# Altium schematic sheet Radio.SchDoc
size A
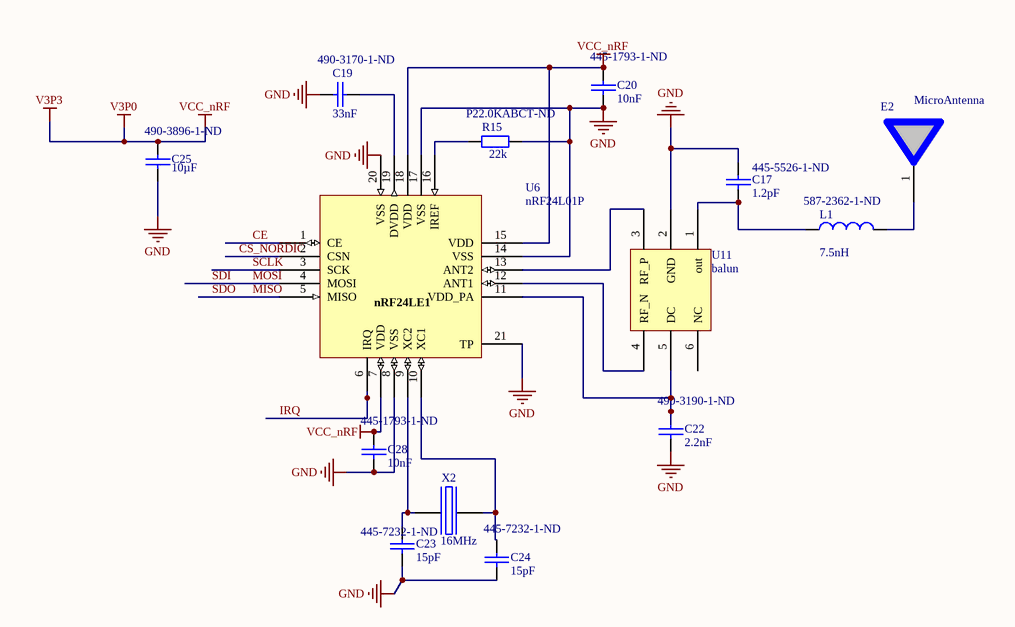
[diagram p0: Radio.SchDoc]

## Parts
C17  value 1.2pF  Supplier Part Number 1: 445-5526-1-ND  [0201]  (hidden comment: NP0 50V)
C19  value 33nF  Supplier Part Number 1: 490-3170-1-ND  [0201]  (hidden comment: NP0 50V)
C20  value 10nF  Supplier Part Number 1: 445-1793-1-ND  [0201]  (hidden comment: NP0 50V)
C22  value 2.2nF  Supplier Part Number 1: 490-3190-1-ND  [0201]  (hidden comment: NP0 50V)
C23  value 15pF  Supplier Part Number 1: 445-7232-1-ND  [0603]  (hidden comment: NP0 50V)
C24  value 15pF  Supplier Part Number 1: 445-7232-1-ND  [0603]  (hidden comment: NP0 50V)
C25  Supplier Part Number 1: 490-3896-1-ND  Capacitance: 10µF  [1608[0603]]  (hidden comment: NP0 50V)
C28  value 10nF  Supplier Part Number 1: 445-1793-1-ND  [0201]  (hidden comment: NP0 50V)
E2  MicroAntenna  [microantenna]
L1  value 7.5nH  Supplier Part Number 1: 587-2362-1-ND  [0201]  (hidden comment: Inductor)
R15  value 22k  Supplier Part Number 1: P22.0KABCT-ND  [0201]  (hidden comment: Res2)
U6  value nRF24L01P  [NORDIC_QFN20P400X400X90-25N]  (hidden comment: QFN24 4x4 package)
U11  balun  [balun]
X2  value 16MHz  [bt-xtal 2.5 x 2 mm]  (hidden comment: TSX-3225, 16MHz, Cl=9pF, +/-10ppm)

## Nets
GND: C17.1 C19.1 C20.2 C22.2 C23.2 C24.1 C25.2 C28.2 R15.2 U6.8(VSS) U6.14(VSS) U6.17(VSS) U6.20(VSS) U6.21(TP) U11.2(GND) X2.2(GND) X2.4(GND)
V3P0: C20.1 C25.1 C28.1 U6.7(VDD) U6.15(VDD) U6.18(VDD)  [also labelled V3P3, VCC_nRF]
CE: U6.1(CE)
CS_NORDIC: U6.2(CSN)
IRQ: U6.6(IRQ)
MISO: U6.5(MISO)  [also labelled SDO]
MOSI: U6.4(MOSI)  [also labelled SDI]
SCLK: U6.3(SCK)
NetC17_2: C17.2 L1.1 U11.1(out)
NetC19_2: C19.2 U6.19(DVDD)
NetC22_1: C22.1 U6.11(VDD_PA) U11.5(DC)
NetC23_1: C23.1 U6.9(XC2) X2.1(inp)
NetC24_2: C24.2 U6.10(XC1) X2.3(out)
NetE2_1: E2.1 L1.2
NetR15_1: R15.1 U6.16(IREF)
NetU6_12: U6.12(ANT1) U11.4(RF_N)
NetU6_13: U6.13(ANT2) U11.3(RF_P)

Not connected (* = marked no-connect by the designer): E2 2; U11 6(NC)

## Notes on the sheet
- (in symbol nRF24L01P - 4x4) nRF24LE1

## Library data of the parts
C17 = Cap: Capacitor; Part Field 1: 0402; Manufacturer: TDK Corporation; Manufacturer Part Number: C0603C0G1E1R2BTQ; Description: CAP CER 1.2PF 25V NP0 0201; Voltage - Rated: 25V; Tolerance: ±0.1pF; Temperature Coefficient: C0G, NP0; Supplier 1: Digi-Key; RoHS: RoHS Compliant; Category: Capacitors; Stock 1: 22019; Pricing 1: 1=0.33, 10=0.22, 100=0.088, 250=0.06324, 500=0.0451, 1000=0.033 (USD); Capacitance: 1.2pF; Mounting Type: Surface Mount, MLCC; Operating Temperature: -55°C ~ 125°C; Applications: RF, Microwave, High Frequency; Ratings: -; Package / Case: 0201 (0603 Metric); Size / Dimension: 0.024" L x 0.012" W (0.60mm x 0.30mm); Height - Seated (Max): -; Thickness (Max): 0.013" (0.33mm); Lead Spacing: -; Features: High Q, Low Loss; Packaging: Cut Tape (CT); Lead Style: -; ComponentLink1URL: http://www.tdk.com/pdf/high_q_B11.pdf; ComponentLink1Description: http://www.tdk.com/pdf/high_q_B11.pdf
C19 = Cap: Capacitor; Part Field 1: 0402; Manufacturer: Murata Electronics North America; Manufacturer Part Number: GRM033R60J333KE01D; Description: CAP CER 0.033UF 6.3V X5R 0201; Capacitance: 0.033µF; Voltage - Rated: 6.3V; Tolerance: ±10%; Temperature Coefficient: X5R; Supplier 1: Digi-Key; RoHS: RoHS Compliant; Category: Capacitors; Stock 1: 79017; Pricing 1: 10=0.05, 50=0.0396, 100=0.0297, 250=0.02144, 500=0.01584, 1000=0.01073 (USD); Mounting Type: Surface Mount, MLCC; Operating Temperature: -55°C ~ 85°C; Applications: General Purpose; Ratings: -; Package / Case: 0201 (0603 Metric); Size / Dimension: 0.024" L x 0.012" W (0.60mm x 0.30mm); Height - Seated (Max): -; Thickness (Max): 0.013" (0.33mm); Lead Spacing: -; Features: -; Packaging: Cut Tape (CT); Lead Style: -; ComponentLink1URL: http://search.murata.co.jp/Ceramy/image/img/PDF/ENG/GRM033R60J333KE01.pdf; ComponentLink1Description: http://search.murata.co.jp/Ceramy/image/img/PDF/ENG/GRM033R60J333KE01.pdf
C20 C28 = Cap: Capacitor; Part Field 1: 0402; Manufacturer: TDK Corporation; Manufacturer Part Number: C0603X5R1A103K; Description: CAP CER 10000PF 10V 10% X5R 0201; Capacitance: 10000pF; Voltage - Rated: 10V; Tolerance: ±10%; Temperature Coefficient: X5R; Supplier 1: Digi-Key; RoHS: RoHS Compliant; Category: Capacitors; Stock 1: 651645; Pricing 1: 1=0.08, 10=0.05, 100=0.018, 250=0.013, 500=0.0096, 1000=0.0065 (USD); Mounting Type: Surface Mount, MLCC; Operating Temperature: -55°C ~ 85°C; Applications: General Purpose; Ratings: -; Package / Case: 0201 (0603 Metric); Size / Dimension: 0.024" L x 0.012" W (0.60mm x 0.30mm); Height - Seated (Max): -; Thickness (Max): 0.013" (0.33mm); Lead Spacing: -; Features: -; Packaging: Cut Tape (CT); Lead Style: -; ComponentLink1URL: http://www.tdk.com/pdf/general_B11.pdf; ComponentLink1Description: http://www.tdk.com/pdf/general_B11.pdf
C22 = Cap: Capacitor; Manufacturer: Murata Electronics North America; Manufacturer Part Number: GRM033R71C222KA88D; Description: CAP CER 2200PF 16V 10% X7R 0201; Capacitance: 2200pF; Voltage - Rated: 16V; Tolerance: ±10%; Temperature Coefficient: X7R; Supplier 1: Digi-Key; RoHS: RoHS Compliant; Category: Capacitors; Stock 1: 60723; Pricing 1: 10=0.032, 50=0.0252, 100=0.0189, 250=0.01364, 500=0.01008, 1000=0.00683, 5000=0.00525 (USD); Mounting Type: Surface Mount, MLCC; Operating Temperature: -55°C ~ 125°C; Applications: General Purpose; Ratings: -; Package / Case: 0201 (0603 Metric); Size / Dimension: 0.024" L x 0.012" W (0.60mm x 0.30mm); Height - Seated (Max): -; Thickness (Max): 0.013" (0.33mm); Lead Spacing: -; Features: -; Packaging: Cut Tape (CT); Lead Style: -; ComponentLink1URL: http://search.murata.co.jp/Ceramy/image/img/PDF/ENG/GRM033R71C222KA88.pdf; ComponentLink1Description: http://search.murata.co.jp/Ceramy/image/img/PDF/ENG/GRM033R71C222KA88.pdf
C23 C24 = Cap: Capacitor; Part Field 1: 0402; Manufacturer: TDK Corporation; Manufacturer Part Number: C0603C0G1E150G; Description: CAP CER 15PF 25V 2% NP0 0201; Voltage - Rated: 25V; Tolerance: ±2%; Temperature Coefficient: C0G, NP0; Supplier 1: Digi-Key; RoHS: RoHS Compliant; Category: Capacitors; Stock 1: 29640; Pricing 1: 1=0.15, 10=0.093, 100=0.0333, 250=0.02404, 500=0.01776, 1000=0.01203 (USD); Capacitance: 15pF; Mounting Type: Surface Mount, MLCC; Operating Temperature: -55°C ~ 125°C; Applications: General Purpose; Ratings: -; Package / Case: 0201 (0603 Metric); Size / Dimension: 0.024" L x 0.012" W (0.60mm x 0.30mm); Height - Seated (Max): -; Thickness (Max): 0.013" (0.33mm); Lead Spacing: -; Features: -; Packaging: Cut Tape (CT); Lead Style: -; ComponentLink1URL: http://www.tdk.com/pdf/general_B11.pdf; ComponentLink1Description: http://www.tdk.com/pdf/general_B11.pdf
C25 = Cap: Capacitor; Part Field 1: 0402; Manufacturer: Murata Electronics North America; Manufacturer Part Number: GRM188R60J106ME47D; Value: 10uF; Description: CAP CER 10UF 6.3V X5R 0603; Voltage - Rated: 6.3V; Tolerance: ±20%; Temperature Coefficient: X5R; Supplier 1: Digi-Key; RoHS: RoHS Compliant; Category: Capacitors; Stock 1: 1364710; Pricing 1: 1=0.51, 10=0.398, 50=0.2624, 100=0.208, 250=0.15376, 500=0.1194, 1000=0.09407 (USD); Mounting Type: Surface Mount, MLCC; Operating Temperature: -55°C ~ 85°C; Applications: General Purpose; Ratings: -; Package / Case: 0603 (1608 Metric); Size / Dimension: 0.063" L x 0.031" W (1.60mm x 0.80mm); Height: -; Thickness: 0.035" (0.90mm); Lead Spacing: -; Features: -; Packaging: Cut Tape (CT); Lead Style: -; ComponentLink1URL: http://search.murata.co.jp/Ceramy/image/img/PDF/ENG/GRM188R60J106ME47.pdf; ComponentLink1Description: http://search.murata.co.jp/Ceramy/image/img/PDF/ENG/GRM188R60J106ME47.pdf
L1 = Inductor: Manufacturer: Taiyo Yuden; Manufacturer Part Number: HKQ0603S7N5H-T; Code_IEC: 1005; Description: INDUCTOR HI FREQ 7.5NH 0201; Current: 200mA; Tolerance: ±3%; DC Resistance (DCR): 510 mOhm Max; Q @ Freq: 13 @ 500MHz; Frequency - Self Resonant: 4.6GHz; Frequency - Test: 500MHz; Published: 8-Jun-2000; LatestRevisionDate: 29-May-2009; LatestRevisionNote: IPC-7351 Footprint Added.; PackageReference: 0402-A; Publisher: Altium Limited; PackageDescription: Chip Inductor; Code_JEITA: 0402; Supplier 1: Digi-Key; RoHS: RoHS Compliant; Category: Inductors, Coils, Chokes; Stock 1: 99075; Pricing 1: 1=0.06, 10=0.052, 50=0.0488, 100=0.0455, 500=0.03576, 1000=0.02925, 5000=0.0234 (USD); Inductance: 7.5nH; Current - Saturation: -; Current - Temperature Rise: -; Type: -; Shielding: -; Package / Case: 0201 (0603 Metric); Mounting Type: Surface Mount; Packaging: Cut Tape (CT); Operating Temperature: -55°C ~ 125°C; Material - Core: -; Applications: High Frequency; ComponentLink1URL: http://www.yuden.co.jp/productdata/catalog/en/mlci05_e.pdf; ComponentLink1Description: http://www.yuden.co.jp/productdata/catalog/en/mlci05_e.pdf
R15 = Res2: Resistor; Manufacturer: Panasonic - ECG; Manufacturer Part Number: ERJ-1GEF2202C; Description: RES 22.0K OHM 1/20W 1% 0201 SMD; Power (Watts): 0.05W, 1/20W; Temperature Coefficient: ±200ppm/°C; Tolerance: ±1%; Category: Resistors; Supplier 1: Digi-Key; RoHS: RoHS Compliant; Stock 1: 526882; Pricing 1: 1=0.11, 50=0.0414, 100=0.0315, 250=0.0234, 500=0.01728, 1000=0.01152, 5000=0.0081 (USD); Resistance (Ohms): 22K; Composition: Thick Film; Features: -; Size / Dimension: 0.024" L x 0.012" W (0.60mm x 0.30mm); Height: 0.010" (0.26mm); Number of Terminations: 2; Packaging: Cut Tape (CT); Package / Case: 0201 (0603 Metric); ComponentLink1URL: http://industrial.panasonic.com/www-data/pdf/AOA0000/AOA0000CE2.pdf; ComponentLink1Description: http://industrial.panasonic.com/www-data/pdf/AOA0000/AOA0000CE2.pdf
U6 = nRF24L01P - 4x4: 2.4GHz Tranceiver with embedded MCU and 10 bit ADC
X2 = BT-XTAL: Crystal; Manufacturer: NDK; Manufacturer Part Number: NX2520SA-16.000000MHZ; Description: CRYSTAL 16.000000 MHZ 10PF SMD; Frequency Stability: ±10ppm; Load Capacitance: 10pF; Operating Mode: Fundamental; Supplier 1: Digi-Key; Supplier Part Number 1: 644-1059-1-ND; RoHS: RoHS Compliant; Category: Crystals and Oscillators; Stock 1: 12667; Pricing 1: 1=2.12, 10=1.839, 50=1.6128, 100=1.2733, 500=1.07524, 750=0.93943, 1000=0.84888 (USD); Type: MHz Crystal; Frequency: 16MHz; Frequency Tolerance: ±10ppm; Operating Temperature: -10°C ~ 60°C; Mounting Type: Surface Mount; Package / Case: 4-SMD, No Lead (DFN, LCC); Size / Dimension: 0.098" L x 0.079" W (2.50mm x 2.00mm); Height: 0.026" (0.65mm); Packaging: Cut Tape (CT); ComponentLink1URL: http://media.digikey.com/pdf/Data%20Sheets/NDK%20PDFs/NX2520SA.pdf; ComponentLink1Description: http://media.digikey.com/pdf/Data%20Sheets/NDK%20PDFs/NX2520SA.pdf